# Altium schematic sheet Charger.SchDoc
size A4; SheetNumber: 2; SheetTotal: 4
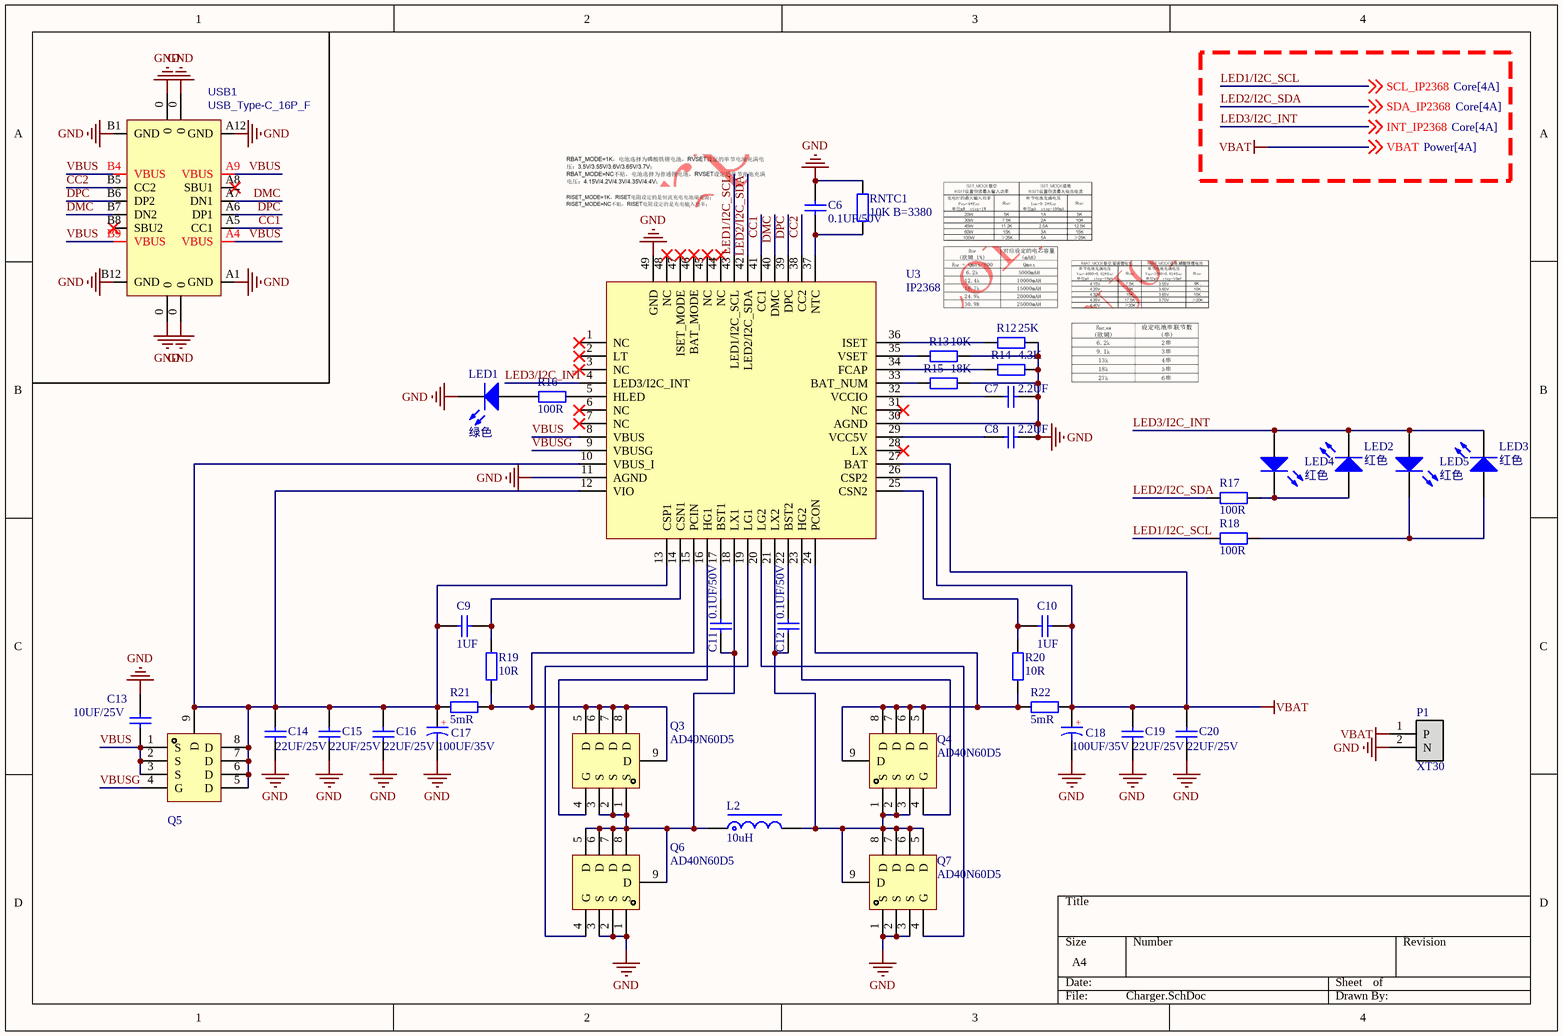
[diagram p0: Charger.SchDoc]

## Parts
C6  0.1UF/50V  [C0603_NS]
C7  2.2UF  [C0603_NS]
C8  2.2UF  [C0603_NS]
C9  1UF  [C0402_NS]
C10  1UF  [C0402_NS]
C11  0.1UF/50V  [C0603_NS]
C12  0.1UF/50V  [C0603_NS]
C13  10UF/25V  [C0805_NS]
C14  22UF/25V  [C0805_NS]
C15  22UF/25V  [C0805_NS]
C16  22UF/25V  [C0805_NS]
C17  100UF/35V  [CE D(6.3*7.7)]
C18  100UF/35V  [CE D(6.3*7.7)]
C19  22UF/25V  [C0805_NS]
C20  22UF/25V  [C0805_NS]
L2  10uH  [L-SMD-1040]
LED1  绿色  [LED0603_G]
LED2  红色  [LED0603_R]
LED3  红色  [LED0603_R]
LED4  红色  [LED0603_R]
LED5  红色  [LED0603_R]
P1  XT30  [XT30PW-M]
Q3  AD40N60D5  [POWERVDFN8_L6.0_W5.0_P1.27]
Q4  AD40N60D5  [POWERVDFN8_L6.0_W5.0_P1.27]
Q5  AON7544  [DFN8_L3.3_W3.3_P0.65]  (value not drawn)
Q6  AD40N60D5  [POWERVDFN8_L6.0_W5.0_P1.27]
Q7  AD40N60D5  [POWERVDFN8_L6.0_W5.0_P1.27]
R12  25K  [R0402_NS]
R13  10K  [R0402_NS]
R14  4.3K  [R0402_NS]
R15  18K  [R0402_NS]
R16  100R  [R0402_NS]
R17  100R  [R0402_NS]
R18  100R  [R0402_NS]
R19  10R  [R0402_NS]
R20  10R  [R0402_NS]
R21  5mR  [R1206_NS]
R22  5mR  [R1206_NS]
RNTC1  10K B=3380  [R0805_NS]
U3  IP2368  [QFN48_L7.0_W7.0_P0.5]
USB1  USB_Type-C_16P_F  [USB_Type-C_SMD_16P_F]

## Nets
GND: C6.2 C7.2 C8.2 C13.2 C14.1 C15.1 C16.1 C17.2 C18.2 C19.1 C20.1 LED1.2(K) P1.2(N) Q6.1(S) Q6.2(S) Q6.3(S) Q7.1(S) Q7.2(S) Q7.3(S) R12.2 R13.2 R14.1 R15.1 RNTC1.2 U3.11(AGND) U3.30(AGND) U3.49(GND) USB1.0 USB1.A1(GND) USB1.A12(GND) USB1.B1(GND) USB1.B12(GND)
VBAT: C10.2 C18.1 C19.2 C20.2 P1.1(P) R22.2 U3.26(CSP2) U3.27(BAT) ; off-sheet VBAT
CC1: U3.41(CC1) USB1.A5(CC1)
CC2: U3.38(CC2) USB1.B5(CC2)
DMC: U3.40(DMC) USB1.A7(DN1) USB1.B7(DN2)
DPC: U3.39(DPC) USB1.A6(DP1) USB1.B6(DP2)
LED1/I2C_SCL: R18.1 U3.43(LED1/I2C_SCL) ; off-sheet SCL_IP2368  [also labelled SCL_IP2368]
LED2/I2C_SDA: R17.1 U3.42(LED2/I2C_SDA) ; off-sheet SDA_IP2368  [also labelled SDA_IP2368]
LED3/I2C_INT: LED2.2(K) LED3.2(K) LED4.1(A) LED5.1(A) U3.4(LED3/I2C_INT) ; off-sheet INT_IP2368  [also labelled INT_IP2368]
VBUS: C13.1 Q5.1(S) Q5.2(S) Q5.3(S) U3.8(VBUS) USB1.A4(VBUS) USB1.A9(VBUS) USB1.B4(VBUS) USB1.B9(VBUS)
VBUSG: Q5.4(G) U3.9(VBUSG)
NetC6_1: C6.1 RNTC1.1 U3.37(NTC)
NetC7_1: C7.1 U3.32(VCCIO)
NetC8_1: C8.1 U3.29(VCC5V)
NetC9_1: C9.1 C14.2 C15.2 C16.2 C17.1 Q5.5(D) Q5.6(D) Q5.7(D) Q5.8(D) Q5.9(D) R21.1 U3.10(VBUS_I) U3.12(VIO) U3.13(CSP1)
NetC9_2: C9.2 R19.2 U3.14(CSN1)
NetC10_1: C10.1 R20.2 U3.25(CSN2)
NetC11_1: C11.1 L2.1 Q3.1(S) Q3.2(S) Q3.3(S) Q6.5(D) Q6.6(D) Q6.7(D) Q6.8(D) Q6.9(D) U3.18(LX1)
NetC11_2: C11.2 U3.17(BST1)
NetC12_1: C12.1 L2.2 Q4.1(S) Q4.2(S) Q4.3(S) Q7.5(D) Q7.6(D) Q7.7(D) Q7.8(D) Q7.9(D) U3.21(LX2)
NetC12_2: C12.2 U3.22(BST2)
NetLED1_1: LED1.1(A) R16.1
NetLED2_1: LED2.1(A) LED4.2(K) R17.2
NetLED3_1: LED3.1(A) LED5.2(K) R18.2
NetQ3_4: Q3.4(G) U3.16(HG1)
NetQ3_5: Q3.5(D) Q3.6(D) Q3.7(D) Q3.8(D) Q3.9(D) R19.1 R21.2 U3.15(PCIN)
NetQ4_4: Q4.4(G) U3.23(HG2)
NetQ4_5: Q4.5(D) Q4.6(D) Q4.7(D) Q4.8(D) Q4.9(D) R20.1 R22.1 U3.24(PCON)
NetQ6_4: Q6.4(G) U3.19(LG1)
NetQ7_4: Q7.4(G) U3.20(LG2)
NetR12_1: R12.1 U3.36(ISET)
NetR13_1: R13.1 U3.35(VSET)
NetR14_2: R14.2 U3.34(FCAP)
NetR15_2: R15.2 U3.33(BAT_NUM)
NetR16_2: R16.2 U3.5(HLED)

Not connected (* = marked no-connect by the designer): U3 1(NC)* 2(LT)* 3(NC)* 6(NC)* 7(NC)* 28(LX)* 31(NC)* 44(NC)* 45(NC)* 46(BAT_MODE)* 47(ISET_MODE)* 48(NC)*; USB1 A8(SBU1)* B8(SBU2)*

## Notes on the sheet
- (in symbol CE_SMD) +

## Library data of the parts
C6-C16 C19 C20 = C: 贴片电容/MLCC电容; BOM名称: MLCC
C17 C18 = CE_SMD: 贴片固态电容; BOM名称: 贴片电解电容
L2 = L-Molding Choke: 一体成型电感; BOM名称: 一体成型电感
LED1-LED5 = LED: 贴片LED; BOM名称: 贴片LED
P1 = XT30: XT30连接器
Q3 Q4 Q6 Q7 = WSD30100DN56: 类型:N沟道;漏源电压(Vdss):30V;连续漏极电流(Id):100A;功率(Pd):46.3W;导通电阻(RDS(on)@Vgs,Id):4mΩ@10V,20A;; Type: N沟道; Drain Source Voltage (Vdss): 30V; Continuous Drain Current (Id): 100A; Power Dissipation (Pd): 46.3W; Gate Threshold Voltage (Vgs(th)@Id): 2.5V@250uA; Device: WSD30100DN56; LCSC Part Name: N沟道 30V 100A; Supplier Footprint: PDFN-8(5x6); Drain Source On Resistance (RDS(on)@Vgs,Id): 4mΩ@10V,20A
Q5 = AON7544: 类型:N沟道;漏源电压(Vdss):30V;连续漏极电流(Id):50A;导通电阻(RDS(on)Vgs,Id):5.7mΩ@10V,35A;阈值电压(Vgs(th)@Id):2.5V@250uA;; Type: N沟道; Drain Source Voltage (Vdss): 30V; Continuous Drain Current (Id): 50A; Power Dissipation (Pd): 45W; Device: AON7544; LCSC Part Name: N沟道 30V 30A; Supplier Footprint: DFN 3.3x3.3-8; Drain Source On Resistance (RDS(on)@Vgs,Id): 5.7mΩ@10V,35A; Gate Threshold Voltage (Vgs(th)@Id): 2.5V@250uA
R12-R22 RNTC1 = R: 贴片电阻; BOM名称: 贴片电阻
U3 = IP2368: 支持 PD3.0 等多种快充输入输出协议、支持 2~6 节串联电芯 集成升降压驱动 最大充放电功率 100W 的电源管理芯片
USB1 = USB_Type-C_16P_F: USB_Type-C母座; BOM名称: USB_Type-C母座